# EAGLE design SecBadge (EAGLE 7.6.0)
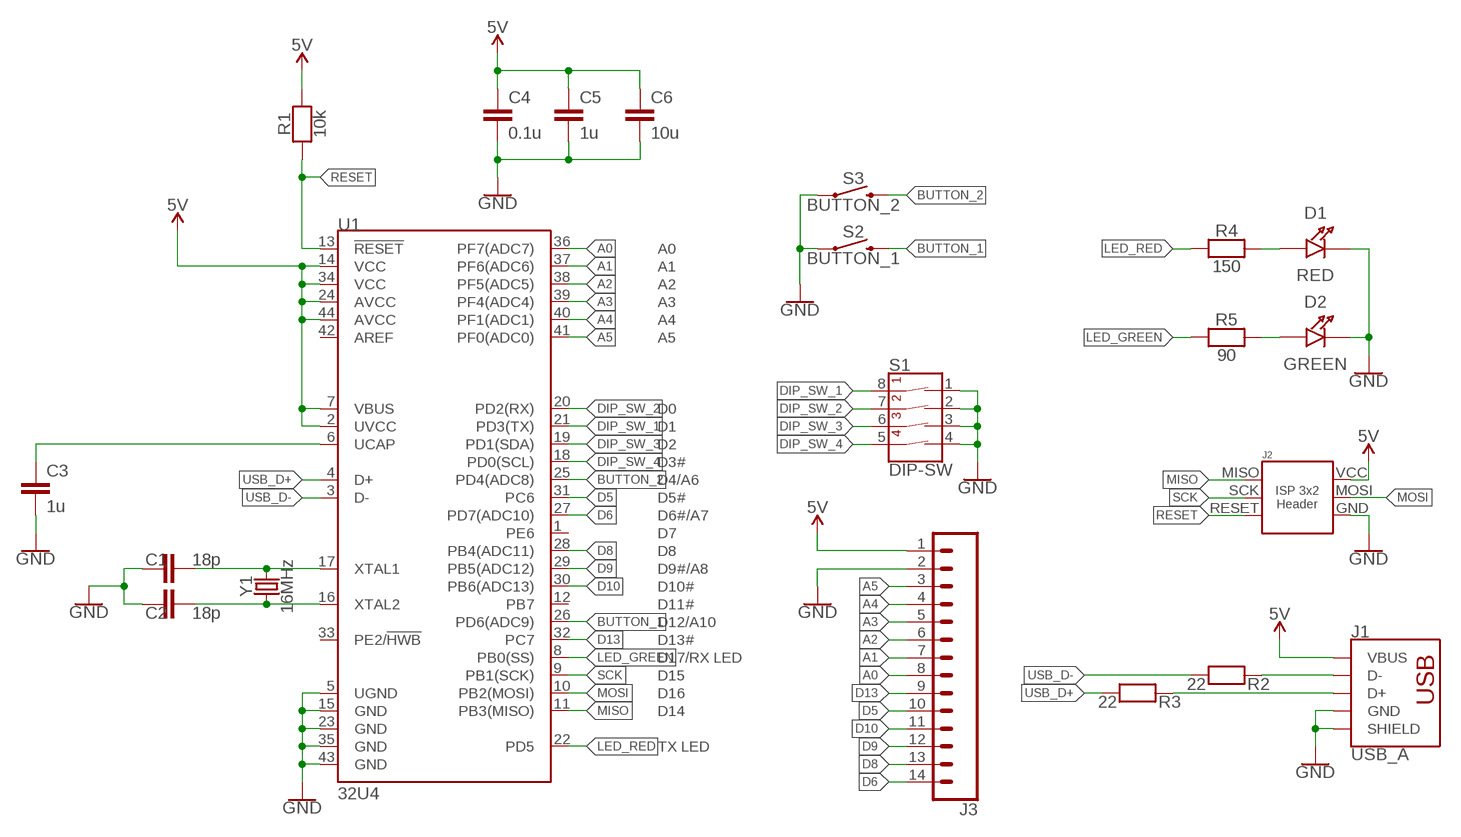
[diagram p0: schematic, sheet 1]

## Parts
C1  18p  CAPACITOR1206  [1206]
C2  18p  CAPACITOR1206  [1206]
C3  1u  CAPACITOR1206  [1206]
C4  0.1u  CAPACITOR1206  [1206]
C5  1u  CAPACITOR1206  [1206]
C6  10u  CAPACITOR1206  [1206]
D1  RED  LED  [LED-1206]
D2  GREEN  LED  [LED-1206]
J1  USB_A  [USB_A_MALE_THT]
J2  AVR_ISP_PROG_3X2  [3X2_NO_SILK]
J3  CONN_14  [1X14]
R1  10k  RESISTOR1206  [1206]
R2  22  RESISTOR1206  [1206]
R3  22  RESISTOR1206  [1206]
R4  150  RESISTOR1206  [1206]
R5  90  RESISTOR1206  [1206]
S1  DIP-SW  DIP-SW-4POSPHT  [DIP8]
S2  BUTTON_1  MOMENTARY-SWITCH-SPST-PTH-6.0MM  [TACTILE_SWITCH_PTH_6.0MM]
S3  BUTTON_2  MOMENTARY-SWITCH-SPST-PTH-6.0MM  [TACTILE_SWITCH_PTH_6.0MM]
U1  32U4  ATMEGA32U4TQFP-44  [TQFP44]
Y1  16MHz  CRYSTALSMD-HC49UP  [HC49UP]

## Nets
5V: C4.1 C5.1 C6.1 J1.VBUS J2.VCC J3.1 R1.1 U1.2(UVCC) U1.7(VBUS) U1.14(VCC) U1.24(AVCC) U1.34(VCC) U1.44(AVCC)
A0: J3.8 U1.36(PF7(ADC7))
A1: J3.7 U1.37(PF6(ADC6))
A2: J3.6 U1.38(PF5(ADC5))
A3: J3.5 U1.39(PF4(ADC4))
A4: J3.4 U1.40(PF1(ADC1))
A5: J3.3 U1.41(PF0(ADC0))
BUTTON_1: S2.3 U1.26(PD6(ADC9))
BUTTON_2: S3.3 U1.25(PD4(ADC8))
D5: J3.10 U1.31(PC6)
D6: J3.14 U1.27(PD7(ADC10))
D8: J3.13 U1.28(PB4(ADC11))
D9: J3.12 U1.29(PB5(ADC12))
D10: J3.11 U1.30(PB6(ADC13))
D13: J3.9 U1.32(PC7)
DIP_SW_1: S1.8(1B) U1.21(PD3(TX))
DIP_SW_2: S1.7(2B) U1.20(PD2(RX))
DIP_SW_3: S1.6(3B) U1.19(PD1(SDA))
DIP_SW_4: S1.5(4B) U1.18(PD0(SCL))
GND: C1.1 C2.1 C3.2 C4.2 C5.2 C6.2 D1.C(CATHODE) D2.C(CATHODE) J1.GND J1.SHIELD1(SHIELD) J1.SHIELD2(SHIELD) J2.GND J3.2 S1.1(1A) S1.2(2A) S1.3(3A) S1.4(4A) S2.1 S3.1 U1.5(UGND) U1.15(GND) U1.23(GND) U1.35(GND) U1.43(GND)
LED_GREEN: R5.2 U1.8(PB0(SS))
LED_RED: R4.2 U1.22(PD5)
MISO: J2.MISO U1.11(PB3(MISO))
MOSI: J2.MOSI U1.10(PB2(MOSI))
N$1: C1.2 U1.17(XTAL1) Y1.2
N$2: J1.D- R2.2
N$3: J1.D+ R3.2
N$4: C2.2 U1.16(XTAL2) Y1.1
N$7: C3.1 U1.6(UCAP)
N$8: D1.A(ANODE) R4.1
N$9: D2.A(ANODE) R5.1
RESET: J2.RESET R1.2 U1.13(!RESET)
SCK: J2.SCK U1.9(PB1(SCK))
USB_D+: R3.1 U1.4(D+)
USB_D-: R2.1 U1.3(D-)
Unconnected: U1.1(PE6) U1.12(PB7) U1.33(PE2/!HWB) U1.42(AREF)

## Library data of the parts
C1-C6 = ZnibbLib:CAPACITOR
D1 D2 = ZnibbLib:LED
J1 = ZnibbLib:USB_A: USB-A Connector USB_A_MALE_THT: https://www.digikey.se/product-detail/en/cnc-tech/1001-010-01001/1175-1007-ND/3064738
J2 = ZnibbLib:AVR_ISP_PROG_3X2: ISP Header
J3 = SparkFun-Connectors:CONN_14: Multi connection point. Often used as Generic Header-pin footprint for 0.1 inch spaced/style header connections On any of the 0.1 inch spaced packages, you can populate with these: Break Away Headers - Straight <https://www.sparkfun.com/products/116> (PRT-00116) Break Away Male Headers - Right Angle <https://www.sparkfun.com/products/553> (PRT-00553) Female Headers <https://www.sparkfun.com/products/115> (PRT-00115) Break Away Headers - Machine Pin <https://www.sparkfun.com/products/117> (PRT-00117) Break Away Female Headers - Swiss Machine Pin <https://www.sparkfun.com/products/743> (PRT-00743) For SCREWTERMINALS and SPRING TERMINALS visit here: Screw Terimnals on SparkFun.com <https://www.sparkfun.com/search/results?term=Screw+Terminals> (5mm/3.5mm/2.54mm spacing) This device is also useful as a general connection point to wire up your design to another part of your project. Our various solder wires solder well into these plated through hole pads. Hook-Up Wire - Assortment (Stranded, 22 AWG) <https://www.sparkfun.com/products/11375> (PRT-11375) Hook-Up Wire - Assortment (Solid Core, 22 AWG) <https://www.sparkfun.com/products/11367> (PRT-11367) View the entire wire category on our website here <https://www.sparkfun.com/categories/141> Special notes: Molex polarized connector foot print use with SKU : PRT-08231 with associated crimp pins and housings. 1MM SMD Version SKU: PRT-10208 NOTES ON THE VARIANTS LOCK and LOCK_LONGPADS... This footprint was designed to help hold the alignment of a through-hole component (i.e. 6-pin header) while soldering it into place. You may notice that each hole has been shifted either up or down by 0.005 of an inch from it's more standard position (which is a perfectly straight line). This slight alteration caused the pins (the squares in the middle) to touch the edges of the holes. Because they are alternating, it causes a "brace" to hold the component in place. 0.005 has proven to be the perfect amount of "off-center" position when using our standard breakaway headers. Although looks a little odd when you look at the bare footprint, once you have a header in there, the alteration is very hard to notice. Also,if you push a header all the way into place, it is covered up entirely on the bottom side.
R1-R5 = ZnibbLib:RESISTOR
S1 = ZnibbLib:DIP-SW-4POS: 4-Position DIP Switch 4-circuit DIP (dual inline package) switch. Commonly used to physcially set a circuit's behavior. SparkFun Products Prototype Part
S2 S3 = SparkFun-Switches:MOMENTARY-SWITCH-SPST: Momentary Switch (Pushbutton) - SPST Normally-open (NO) SPST momentary switches (buttons, pushbuttons). Variants PTH-12MM - 12mm square, through-hole Momentary Pushbutton Switch - 12mm Square <https://www.sparkfun.com/products/9190> (COM-09190) PTH-6.0MM, PTH-6.0MM-KIT - 6.0mm square, through-hole Mini Pushbutton Switch <https://www.sparkfun.com/products/97> (COM-00097) KIT package intended for soldering kit's - only one side of pads' copper is exposed. PTH-RIGHT-ANGLE-KIT - Right-angle, through-hole Right Angle Tactile Button <https://www.sparkfun.com/products/10791> - Used on SparkFun BigTime Watch Kit <https://www.sparkfun.com/products/11734> SMD-12MM - 12mm square, surface-mount Tactile Button - SMD (12mm) <https://www.sparkfun.com/products/12993> (COM-12993) Used on SparkFun PicoBoard <https://www.sparkfun.com/products/11888> SMD-4.5MM - 4.5mm Square Trackball Switch Used on SparkFun Blackberry Trackballer Breakout <https://www.sparkfun.com/products/13169> SMD-4.6MMX2.8MM - 4.60mm x 2.80mm, surface mount Used on SparkFun SAMD21 Mini Breakout <https://www.sparkfun.com/products/13664> SMD-5.2MM, SMD-5.2-REDUNDANT - 5.2mm square, surface-mount Mini Pushbutton Switch - SMD <https://www.sparkfun.com/products/8720> (COM-08720) Used on Arduino Pro Mini <https://www.sparkfun.com/products/11114> REDUNDANT package connects both switch circuits together SMD-6.0X3.5MM - 6.0 x 3.5mm, surface mount Momentary Reset Switch SMD <https://www.sparkfun.com/products/8229> (COM-08229) SMD-6.2MM-TALL - 6.2mm square, surface mount Tactile Button - SMD (6mm) <https://www.sparkfun.com/products/12992> Used on SparkFun Digital Sandbox <https://www.sparkfun.com/products/12651> SMD-RIGHT-ANGLE - Right-angle, surface mount Used on SparkFun Block for Intel® Edison - Arduino <https://www.sparkfun.com/products/13036>; PROD_ID: SWCH-08441; SF_SKU: COM-00097
U1 = ZnibbLib:ATMEGA32U4: Atmel MCU, 32KByte Atmel 44-pin 8-bit Microcontroller with 32KBytes of ISP Flash and USB Controller Datasheet <http://cdn.sparkfun.com/datasheets/Dev/Arduino/Boards/ATMega32U4.pdf> SparkFun Products LilyPad Arduino USB - ATmega32U4 Board <https://www.sparkfun.com/products/12049> (DEV-12049) Pro Micro - 5V/16MHz <https://www.sparkfun.com/products/12640> (DEV-12640) Pro Micro - 3.3V/8MHz <https://www.sparkfun.com/products/12587> (DEV-12587) Fio v3 - ATmega32U4 <https://www.sparkfun.com/products/11520> (DEV-11520) Qduino Mini <https://www.sparkfun.com/products/13614> (DEV-13614) Makey Makey - Standard Kit <https://www.sparkfun.com/products/11511> (WIG-11511) Makey Makey Deluxe Kit <https://www.sparkfun.com/products/11519> (WIG-11519); PROD_ID: IC-11161
Y1 = SparkFun-Clocks:CRYSTAL: Crystals (Generic) These are passive quartz crystals, which can be used as a clock source for a microcontroller. Crystal's are two-terminal devices. They require external "load" capacitors to generate an oscillating signal.

## Board
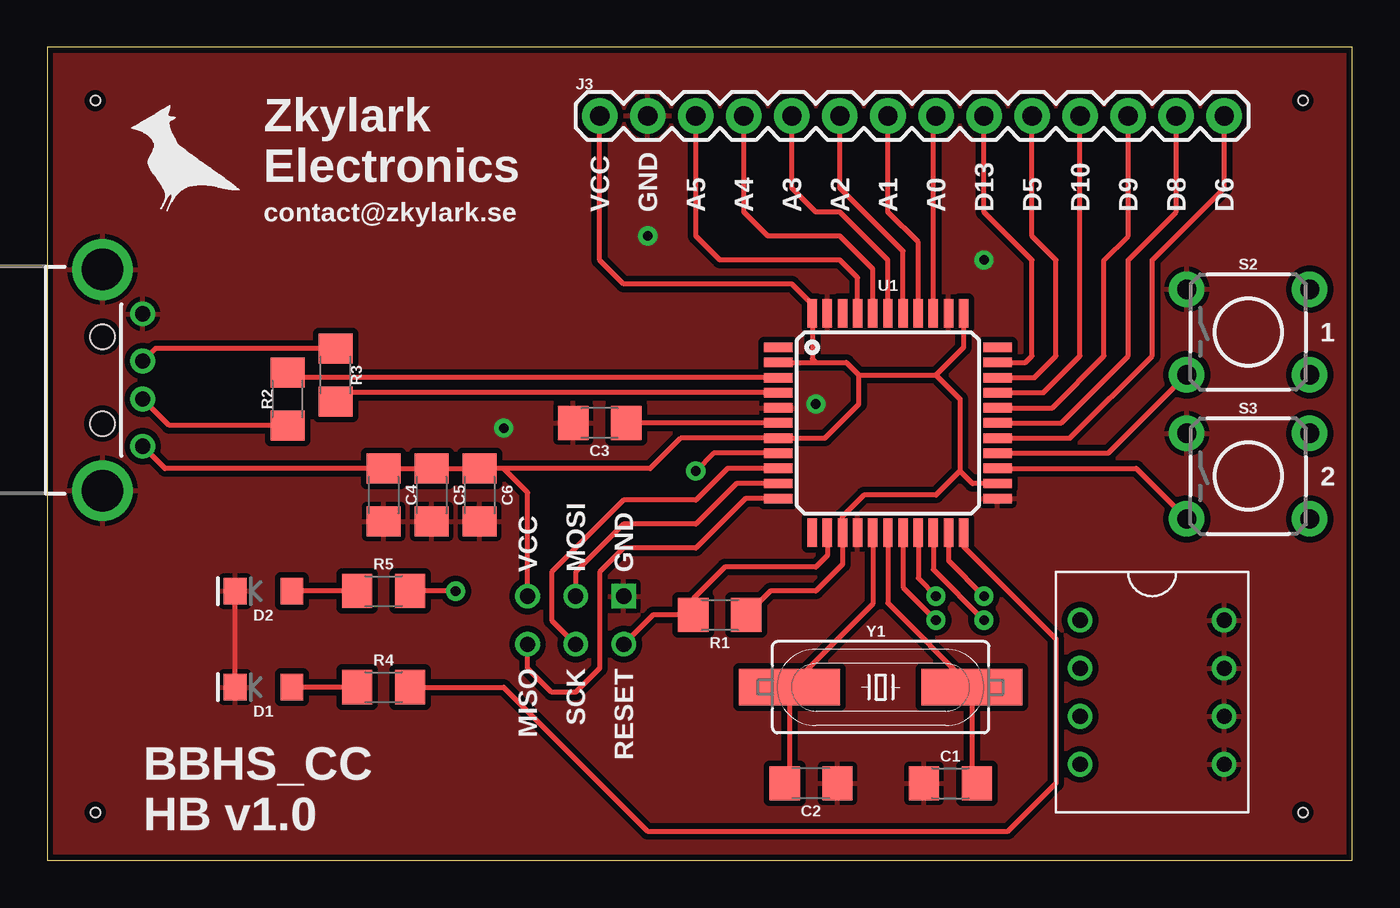
[diagram p1: board, top side]
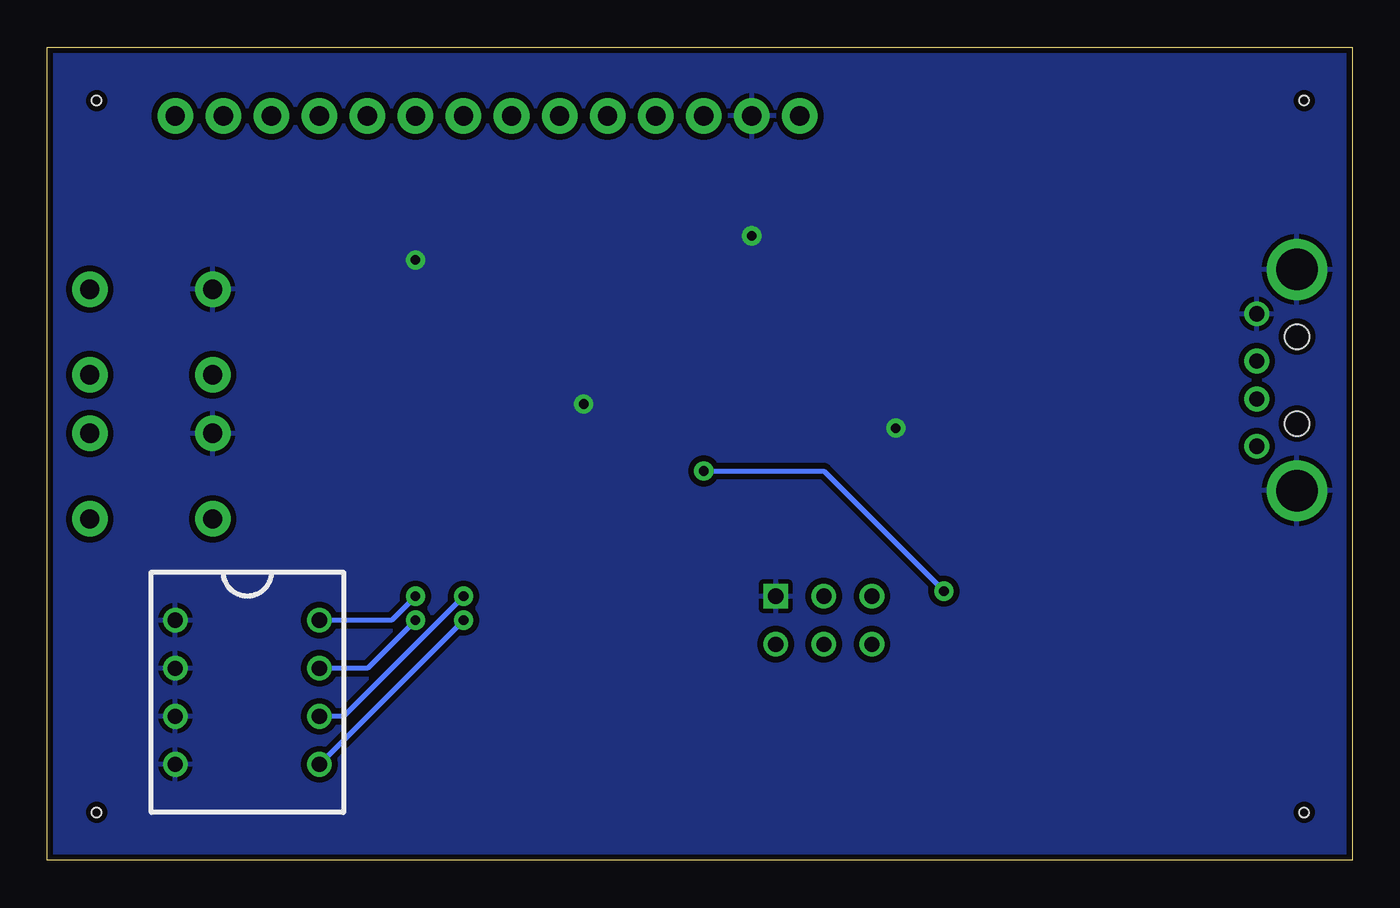
[diagram p2: board, bottom side, seen from below]

Size 69 x 43 mm. Coordinates in mm from the lower left corner, seen from the top.
Outline: 0,0 69,0 69,43 0,43 0,0
Copper layers (1*16): Top 0.035mm / dielectric 1.5mm / Bottom 0.035mm
Design rules "SparkFun-2-layer-STANDARD": minimum track width 10mil, minimum drill 20mil, track to track 10mil, track to pad 8mil, pad to pad 8mil, via to via 10mil, smd to smd 8mil, copper to edge 8mil, drill to drill 8mil, minimum pad ring 10mil, minimum via ring 10mil, stop-mask expansion 4mil, vias tented up to drill 25mil, thermal gap 10mil
Holes 0.51 mm at 2.54,40.18 66.39,40.18 66.39,2.54 2.54,2.54

### Footprints (pad centres in the part's own frame; a part is rotated, then mirrored left to right if it is on the bottom)
1206 = smd 1.6 x 1.8: 1 -1.4,0; 2 1.4,0
LED-1206 = smd 1.2 x 1.4: A -1.5,0; C 1.5,0
USB_A_MALE_THT = drill 0.8 pad 1.27: D+ 2.13,1; D- 2.13,-1; GND 2.13,3.5; VBUS 2.13,-3.5 | drill 2.2: SHIELD1 0,-5.85; SHIELD2 0,5.85 | hole 1.3: 0,2.3; 0,-2.3
3X2_NO_SILK = drill 0.8 square: GND 1.27,-2.54 | drill 0.8: MISO -1.27,2.54; MOSI 1.27,0; RESET -1.27,-2.54; SCK -1.27,0; VCC 1.27,2.54
1X14 = drill 1.016 pad 1.88: 1 0,0; 2 2.54,0; 3 5.08,0; 4 7.62,0; 5 10.16,0; 6 12.7,0; 7 15.24,0; 8 17.78,0; 9 20.32,0; 10 22.86,0; 11 25.4,0; 12 27.94,0; 13 30.48,0; 14 33.02,0
DIP8 = drill 0.8: 1 3.81,3.81; 2 3.81,1.27; 3 3.81,-1.27; 4 3.81,-3.81; 5 -3.81,-3.81; 6 -3.81,-1.27; 7 -3.81,1.27; 8 -3.81,3.81
TACTILE_SWITCH_PTH_6.0MM = drill 1.016 pad 1.88: 1 -3.251,2.261; 2 3.251,2.261; 3 -3.251,-2.261; 4 3.251,-2.261
TQFP44 = smd 1.5 x 0.5: 1 -5.8,4; 2 -5.8,3.2; 3 -5.8,2.4; 4 -5.8,1.6; 5 -5.8,0.8; 6 -5.8,0; 7 -5.8,-0.8; 8 -5.8,-1.6; 9 -5.8,-2.4; 10 -5.8,-3.2; 11 -5.8,-4; 23 5.8,-4; 24 5.8,-3.2; 25 5.8,-2.4; 26 5.8,-1.6; 27 5.8,-0.8; 28 5.8,0; 29 5.8,0.8; 30 5.8,1.6; 31 5.8,2.4; 32 5.8,3.2; 33 5.8,4 | smd 0.5 x 1.5: 12 -4,-5.8; 13 -3.2,-5.8; 14 -2.4,-5.8; 15 -1.6,-5.8; 16 -0.8,-5.8; 17 0,-5.8; 18 0.8,-5.8; 19 1.6,-5.8; 20 2.4,-5.8; 21 3.2,-5.8; 22 4,-5.8; 34 4,5.8; 35 3.2,5.8; 36 2.4,5.8; 37 1.6,5.8; 38 0.8,5.8; 39 0,5.8; 40 -0.8,5.8; 41 -1.6,5.8; 42 -2.4,5.8; 43 -3.2,5.8; 44 -4,5.8
HC49UP = smd 5.334 x 1.93: 1 -4.826,0; 2 4.826,0

### Placement (x,y rotation side)
C1  47.75,4.08 0 top
C2  40.39,4.08 180 top
C3  29.21,23.13 180 top
C4  17.78,19.32 270 top
C5  20.32,19.32 270 top
C6  22.86,19.32 270 top
D1  11.43,9.16 180 top
D2  11.43,14.24 180 top
J1  2.92,25.4 0 top
J2  27.94,12.7 90 top
J3  29.21,39.37 0 top
R1  35.56,12.97 180 top
R2  12.7,24.4 270 top
R3  15.24,25.67 90 top
R4  17.78,9.16 0 top
R5  17.78,14.24 0 top
S1  58.42,8.89 0 top
S2  63.5,27.94 0 top
S3  63.5,20.32 0 top
U1  44.45,23.13 0 top
Y1  44.07,9.16 0 top

### Tracks (layer width: path | path; a pad name or v marks a point on that pad's centre or on a via)
5V
  Top 0.254: 42.91,25.67 42.91,24.13 41.11,22.33 U1.7 33.49,22.33 31.88,20.72 24.13,20.72 | U1.2 40.64,26.33 | 40.64,26.33 42.25,26.33 42.91,25.67 | 40.64,26.33 40.45,26.52 U1.44 40.45,29.4 39.37,30.48 30.48,30.48 29.21,31.75 J3.1 | 42.91,25.67 46.99,25.67 | 46.99,25.67 48.26,24.4 48.26,20.59 | 48.26,20.59 46.99,19.32 43.18,19.32 42.05,18.19 U1.14 42.05,15.65 40.64,14.24 38.23,14.24 R1.1 | U1.34 48.45,27.13 46.99,25.67 | U1.24 48.92,19.93 48.26,20.59 | 24.13,20.72 C6.1 C5.1 C4.1 6.23,20.72 J1.VBUS | J2.VCC 25.4,19.45 24.13,20.72
A0
  Top 0.254: U1.36 46.85,39.23 J3.8
A1
  Top 0.254: U1.37 46.05,32.69 44.45,34.29 J3.7
A2
  Top 0.254: U1.38 45.25,32.22 41.91,35.56 J3.6
A3
  Top 0.254: U1.39 44.45,31.75 41.91,34.29 40.64,34.29 39.37,35.56 J3.5
A4
  Top 0.254: U1.40 43.65,31.28 41.91,33.02 38.1,33.02 36.83,34.29 J3.4
A5
  Top 0.254: U1.41 42.85,30.81 41.91,31.75 35.56,31.75 34.29,33.02 J3.3
BUTTON_1
  Top 0.254: U1.26 56.1,21.53 S2.3
BUTTON_2
  Top 0.254: U1.25 57.58,20.73 S3.3
D5
  Top 0.254: U1.31 52.2,25.53 53.34,26.67 53.34,31.75 52.07,33.02 J3.10
D6
  Top 0.254: U1.27 54.08,22.33 58.42,26.67 58.42,31.75 62.23,35.56 J3.14
D8
  Top 0.254: U1.28 53.61,23.13 57.15,26.67 57.15,31.75 59.69,34.29 J3.13
D9
  Top 0.254: U1.29 53.14,23.93 55.88,26.67 55.88,31.75 57.15,33.02 J3.12
D10
  Top 0.254: U1.30 52.67,24.73 54.61,26.67 J3.11
D13
  Top 0.254: U1.32 51.73,26.33 52.07,26.67 52.07,31.75 49.53,34.29 J3.9
DIP_SW_1  (via drill 0.51)
  Top 0.254: U1.21 47.65,15.85 v49.53,13.97
  Bottom 0.254: v49.53,13.97 50.8,12.7 S1.8
DIP_SW_2  (via drill 0.51)
  Top 0.254: U1.20 46.85,15.38 v49.53,12.7
  Bottom 0.254: v49.53,12.7 52.07,10.16 S1.7
DIP_SW_3  (via drill 0.51)
  Top 0.254: U1.19 46.05,14.91 v46.99,13.97
  Bottom 0.254: v46.99,13.97 53.34,7.62 S1.6
DIP_SW_4  (via drill 0.51)
  Top 0.254: U1.18 45.25,14.44 v46.99,12.7
  Bottom 0.254: v46.99,12.7 S1.5
GND  (via drill 0.51)
  Top 0.254: D1.C D2.C
  other vias: 40.64,24.13 24.13,22.86 31.75,33.02 49.53,31.75
  pour Top (isolate 0.305): -1,-1 70,-1 70,44 -1,44
  pour Bottom (isolate 0.305): -1,-1 70,-1 70,44 -1,44
LED_GREEN  (via drill 0.51)
  Top 0.254: U1.8 35.23,21.53 v34.29,20.59 | v21.59,14.24 R5.2
  Bottom 0.254: v34.29,20.59 27.94,20.59 v21.59,14.24
LED_RED
  Top 0.254: R4.2 24.13,9.16 31.75,1.54 50.8,1.54 53.34,4.08 53.34,11.7 48.45,16.59 U1.22
MISO
  Top 0.254: U1.11 36.91,19.13 34.29,16.51 30.48,16.51 29.21,15.24 29.21,10.16 27.94,8.89 26.67,8.89 25.4,10.16 J2.MISO
MOSI
  Top 0.254: U1.10 36.44,19.93 34.29,17.78 30.48,17.78 27.94,15.24 J2.MOSI
N$1
  Top 0.254: U1.17 44.45,13.61 Y1.2 48.9,4.34 C1.2
N$2
  Top 0.254: R2.2 6.45,23 J1.D-
N$3
  Top 0.254: R3.2 5.72,27.07 J1.D+
N$4
  Top 0.254: U1.16 43.65,13.57 Y1.1 39.24,4.34 C2.2
N$7
  Top 0.254: U1.6 C3.1
N$8
  Top 0.254: R4.1 D1.A
N$9
  Top 0.254: R5.1 D2.A
RESET
  Top 0.254: U1.13 41.25,16.12 40.64,15.51 35.83,15.51 34.16,13.84 R1.2 32.02,12.97 J2.RESET
SCK
  Top 0.254: U1.9 35.97,20.73 34.29,19.05 30.48,19.05 26.67,15.24 26.67,12.7 J2.SCK
USB_D+
  Top 0.254: U1.4 15.7,24.73 R3.1
USB_D-
  Top 0.254: U1.3 12.97,25.53 R2.1

### Text on the board
tPlace: Zkylark / Electronics | contact@zkylark.se | VCC | GND | A5 | A4 | A3 | A2 | A1 | A0 | D13 | D5 | D10 | D9 | D8 | D6 | 1 | 2 | VCC | MOSI | GND | MISO | SCK | RESET | BBHS_CC / HB v1.0